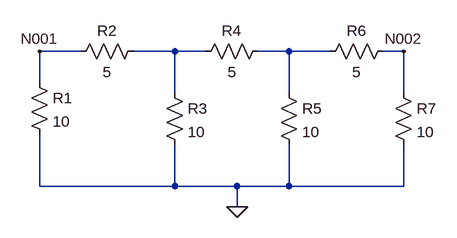
[diagram p0: schematic Rnetwork.asc]
Rnetwork.asc, the LTspice schematic file:
Version 4
SHEET 1 880 680
WIRE 176 96 112 96
WIRE 320 96 256 96
WIRE 368 96 320 96
WIRE 496 96 448 96
WIRE 560 96 496 96
WIRE 672 96 640 96
WIRE 112 144 112 96
WIRE 320 160 320 96
WIRE 496 160 496 96
WIRE 672 160 672 96
WIRE 112 304 112 224
WIRE 320 304 320 240
WIRE 320 304 112 304
WIRE 416 304 320 304
WIRE 496 304 496 240
WIRE 496 304 416 304
WIRE 672 304 672 240
WIRE 672 304 496 304
WIRE 416 336 416 304
FLAG 416 336 0
FLAG 112 96 N001
FLAG 672 96 N002
SYMBOL res 96 128 R0
SYMATTR InstName R1
SYMATTR Value 10
SYMBOL res 272 80 R90
WINDOW 0 0 56 VBottom 2
WINDOW 3 32 56 VTop 2
SYMATTR InstName R2
SYMATTR Value 5
SYMBOL res 304 144 R0
SYMATTR InstName R3
SYMATTR Value 10
SYMBOL res 464 80 R90
WINDOW 0 0 56 VBottom 2
WINDOW 3 32 56 VTop 2
SYMATTR InstName R4
SYMATTR Value 5
SYMBOL res 480 144 R0
SYMATTR InstName R5
SYMATTR Value 10
SYMBOL res 656 80 R90
WINDOW 0 0 56 VBottom 2
WINDOW 3 32 56 VTop 2
SYMATTR InstName R6
SYMATTR Value 5
SYMBOL res 656 144 R0
SYMATTR InstName R7
SYMATTR Value 10

The netlist it stands for:
* Rnetwork.asc
R1 N001 0 10
R2 N003 N001 5
R3 N003 0 10
R4 N004 N003 5
R5 N004 0 10
R6 N002 N004 5
R7 N002 0 10
.backanno
.end